# Altium project MicrobitBoardExtend.PrjPcb
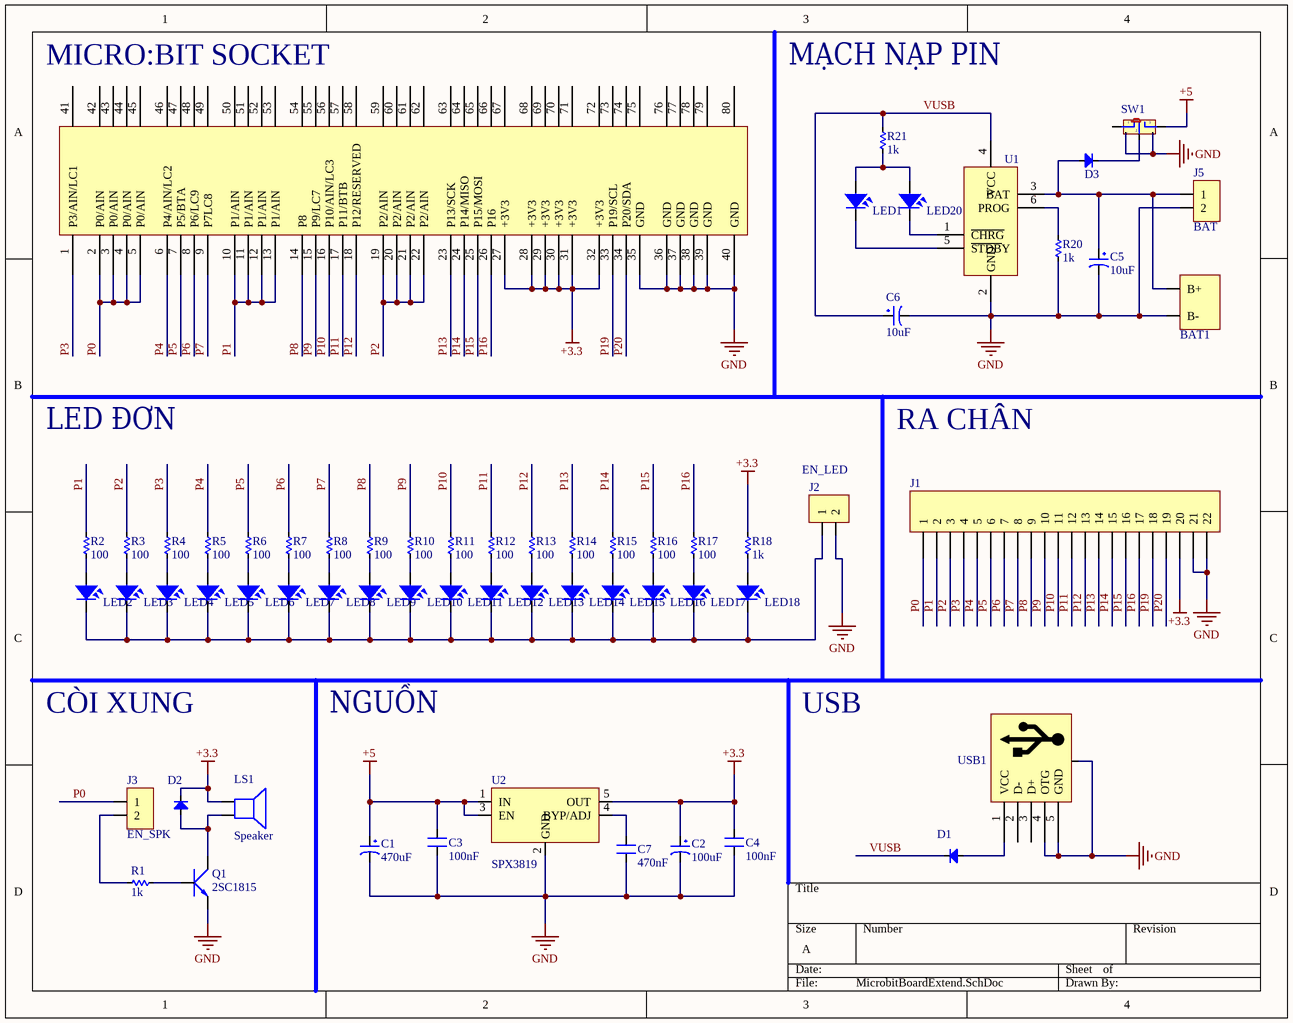
[diagram p0: MicrobitBoardExtend.SchDoc]
1 sheet, 61 parts. Net scope: global (net labels, ports and power ports of the same name join across sheets).
Board file: MicrobitBoardExtend.PcbDoc

## Sheet MicrobitBoardExtend.SchDoc
size A

### Parts
BAT1  BATERRY SOCKET  [BAT_SOCKET]  (value not drawn)
BBC1  BBC_SOCKET  [BBC_SK_DIP]  (value not drawn)
C1  470uF  [tu tantalum smd7343]
C2  100uF  [tu tantalum smd3528]
C3  100nF  [CN-SMD-0805]
C4  100nF  [CN-SMD-0805]
C5  10uF  [tu tantalum smd3528]
C6  10uF  [tu tantalum smd3528]
C7  470nF  [CN-SMD-0805]
D1  SS34  [DIO-SMD-123]  (value not drawn)
D2  SS34  [DIO-SMD-123]  (value not drawn)
D3  SS34  [DIO-SMD-123]  (value not drawn)
J1  JP22  [JP22-D1T]  (value not drawn)
J2  EN_LED  [JP2-CLOSED]
J3  EN_SPK  [JP2-CLOSED]
J5  BAT  [JP2-D1T]
LED1  F  [LED-0805-Blue]  (value not drawn)
LED2  LED  [LED-3MM-BLUE]  (value not drawn)
LED3  LED  [LED-3MM-BLUE]  (value not drawn)
LED4  LED  [LED-3MM-BLUE]  (value not drawn)
LED5  LED  [LED-3MM-BLUE]  (value not drawn)
LED6  LED  [LED-3MM-BLUE]  (value not drawn)
LED7  LED  [LED-3MM-BLUE]  (value not drawn)
LED8  LED  [LED-3MM-BLUE]  (value not drawn)
LED9  LED  [LED-3MM-BLUE]  (value not drawn)
LED10  LED  [LED-3MM-BLUE]  (value not drawn)
LED11  LED  [LED-3MM-BLUE]  (value not drawn)
LED12  LED  [LED-3MM-BLUE]  (value not drawn)
LED13  LED  [LED-3MM-BLUE]  (value not drawn)
LED14  LED  [LED-3MM-BLUE]  (value not drawn)
LED15  LED  [LED-3MM-BLUE]  (value not drawn)
LED16  LED  [LED-3MM-BLUE]  (value not drawn)
LED17  LED  [LED-3MM-BLUE]  (value not drawn)
LED18  PWR  [LED-0805-Blue]  (value not drawn)
LED20  C  [LED-0805-Blue]  (value not drawn)
LS1  Speaker  [SPEAKER]
Q1  2SC1815  [SOT23-321]
R1  1k  [RES-SMD-0805]
R2  100  [RES-SMD-0805]
R3  100  [RES-SMD-0805]
R4  100  [RES-SMD-0805]
R5  100  [RES-SMD-0805]
R6  100  [RES-SMD-0805]
R7  100  [RES-SMD-0805]
R8  100  [RES-SMD-0805]
R9  100  [RES-SMD-0805]
R10  100  [RES-SMD-0805]
R11  100  [RES-SMD-0805]
R12  100  [RES-SMD-0805]
R13  100  [RES-SMD-0805]
R14  100  [RES-SMD-0805]
R15  100  [RES-SMD-0805]
R16  100  [RES-SMD-0805]
R17  100  [RES-SMD-0805]
R18  1k  [RES-SMD-0805]
R20  1k  [RES-SMD-0805]
R21  1k  [RES-SMD-0805]
SW1  SW102A  [SW102]  (value not drawn)
U1  TP4057  [SOT23-6]  (value not drawn)
U2  SPX3819  [SOT23-5]
USB1  PWR  [MicroUSB]  (value not drawn)

### Nets
+3.3: BBC1.27(+3V3) BBC1.28(+3V3) BBC1.29(+3V3) BBC1.30(+3V3) BBC1.31(+3V3) BBC1.32(+3V3) C2.1 C4.1 D2.2(K) J1.20 LS1.1 R18.2 U2.5(OUT)
+5: C1.1 C3.1 SW1.3 U2.1(IN) U2.3(EN)
GND: BAT1.2(B-) BBC1.35(GND) BBC1.36(GND) BBC1.37(GND) BBC1.38(GND) BBC1.39(GND) BBC1.40(GND) C1.2 C2.2 C3.2 C4.2 C5.2 C6.2 C7.2 J1.21 J1.22 J2.2 J5.2 Q1.1(E) R20.1 SW1.4 SW1.5 U1.2(GND) U2.2(GND) USB1.0(GND) USB1.4(OTG) USB1.5(GND)
P0: BBC1.2(P0/AIN) BBC1.3(P0/AIN) BBC1.4(P0/AIN) BBC1.5(P0/AIN) J1.1 J3.1
P1: BBC1.10(P1/AIN) BBC1.11(P1/AIN) BBC1.12(P1/AIN) BBC1.13(P1/AIN) J1.2 R2.2
P2: BBC1.19(P2/AIN) BBC1.20(P2/AIN) BBC1.21(P2/AIN) BBC1.22(P2/AIN) J1.3 R3.2
P3: BBC1.1(P3/AIN/LC1) J1.4 R4.2
P4: BBC1.6(P4/AIN/LC2) J1.5 R5.2
P5: BBC1.7(P5/BTA) J1.6 R6.2
P6: BBC1.8(P6/LC9) J1.7 R7.2
P7: BBC1.9(P7LC8) J1.8 R8.2
P8: BBC1.14(P8) J1.9 R9.2
P9: BBC1.15(P9/LC7) J1.10 R10.2
P10: BBC1.16(P10/AIN/LC3) J1.11 R11.2
P11: BBC1.17(P11/BTB) J1.12 R12.2
P12: BBC1.18(P12/RESERVED) J1.13 R13.2
P13: BBC1.23(P13/SCK) J1.14 R14.2
P14: BBC1.24(P14/MISO) J1.15 R15.2
P15: BBC1.25(P15/MOSI) J1.16 R16.2
P16: BBC1.26(P16) J1.17 R17.2
P19: BBC1.33(P19/SCL) J1.18
P20: BBC1.34(P20/SDA) J1.19
VUSB: C6.1 D1.2(K) R21.2 U1.4(VCC)
NetBAT1_1: BAT1.1(B+) C5.1 D3.1(A) J5.1 U1.3(BAT)
NetC7_1: C7.1 U2.4(BYP/ADJ)
NetD1_1: D1.1(A) USB1.1(VCC)
NetD2_1: D2.1(A) LS1.2 Q1.2(C)
NetD3_2: D3.2(K) SW1.2
NetJ2_1: J2.1 LED2.2 LED3.2 LED4.2 LED5.2 LED6.2 LED7.2 LED8.2 LED9.2 LED10.2 LED11.2 LED12.2 LED13.2 LED14.2 LED15.2 LED16.2 LED17.2 LED18.2
NetJ3_2: J3.2 R1.2
NetLED1_1: LED1.1 LED20.1 R21.1
NetLED1_2: LED1.2 U1.5(~{STDB}Y)
NetLED2_1: LED2.1 R2.1
NetLED3_1: LED3.1 R3.1
NetLED4_1: LED4.1 R4.1
NetLED5_1: LED5.1 R5.1
NetLED6_1: LED6.1 R6.1
NetLED7_1: LED7.1 R7.1
NetLED8_1: LED8.1 R8.1
NetLED9_1: LED9.1 R9.1
NetLED10_1: LED10.1 R10.1
NetLED11_1: LED11.1 R11.1
NetLED12_1: LED12.1 R12.1
NetLED13_1: LED13.1 R13.1
NetLED14_1: LED14.1 R14.1
NetLED15_1: LED15.1 R15.1
NetLED16_1: LED16.1 R16.1
NetLED17_1: LED17.1 R17.1
NetLED18_1: LED18.1 R18.1
NetLED20_2: LED20.2 U1.1(~{CHRG})
NetQ1_3: Q1.3(B) R1.1
NetR20_2: R20.2 U1.6(PROG)

Not connected (* = marked no-connect by the designer): BBC1 41(P3) 42(P0) 43(P0) 44(P0) 45(P0) 46(P4) 47(P5) 48(P6) 49(P7) 50(P1) 51(P1) 52(P1) 53(P1) 54(P8) 55(P9) 56(P10) 57(P11) 58(P12) 59(P2) 60(P2) 61(P2) 62(P2) 63(P13) 64(P14) 65(P15) 66(P16) 67(+3V3) 68(+3V3) 69(+3V3) 70(+3V3) 71(+3V3) 72(+3V3) 73(P19) 74(P20) 75(GND) 76(GND) 77(GND) 78(GND) 79(GND) 80(GND); SW1 1; USB1 2(D-) 3(D+)

### Notes on the sheet
- MICRO:BIT SOCKET
- MẠCH NẠP PIN
- LED ĐƠN
- RA CHÂN
- CÒI XUNG
- NGUỒN
- USB

### Library data of the parts
BAT1 = BAT_SOCKET
C1 = Tu tantalum 470uF 10V SMD7343: Dán; Don_Vi: Con; So_Chan: 2; Ten_Linh_Kien: Tụ tantalum 477A-470uF 10V SMD7343; Ma_Hang: MH001956; Chung_Loai: Dán; Kieu_Chan: *
C2 = Tu tantalum 100uF 6.3V SMD3528: Dán; Don_Vi: Con; So_Chan: 2; Ten_Linh_Kien: Tụ tantalum 107J-100uF 6.3V SMD3528; Ma_Hang: MH007595; Chung_Loai: Dán; Kieu_Chan: *
C3 C4 C7 = CN: Value: 33pF
C5 C6 = Tu tantalum 10uF 16V SMD3528: Dán; Don_Vi: Con; So_Chan: 2; Ten_Linh_Kien: Tụ tantalum 106C-10uF 16V SMD3528; Ma_Hang: MH007474; Chung_Loai: Dán; Kieu_Chan: *
D1-D3 = Diode SMD: Default Diode; Code - JEDEC: DO-214-AB; Value: 1N5007; Published: 8-Jun-2000; Revision: July-2002: Re-released for DXP Platform.; Publisher: Altium Limited
J1 = JP22: WR-PHD 2.54 mm Angled Socket Header; Manufacturer: W¨¹rth Elektronik eiSos GmbH; partNo: 613022143121; ComponentLink1 Description: Manufacturer; ComponentLink2 Description: Datasheet; NoPins: 22; Created Date: 29 March 2013; ComponentLink1URL: http://www.we-online.com; ComponentLink2URL: http://katalog.we-online.de/em/datasheet/6130xx143121.pdf; Created by: Karrer Zheng
J2 J3 J5 = JP2: WR-PHD 2.54 mm Angled Socket Header; Manufacturer: W¨¹rth Elektronik eiSos GmbH; partNo: 613002143121; ComponentLink1 Description: Manufacturer; ComponentLink2 Description: Datasheet; NoPins: 02; Created Date: 29 March 2013; ComponentLink1URL: http://www.we-online.com; ComponentLink2URL: http://katalog.we-online.de/em/datasheet/6130xx143121.pdf; Created by: Karrer Zheng
LED1 LED18 LED20 = LED SMD: Value: LED 3 - 5 ly 2 Colour
LED2-LED17 = LED: LED Single colour Green and Red; Value: LED 3 ly Single Colour
LS1 = Speaker: Loudspeaker; Published: 24-Mar-1999; LatestRevisionDate: 17-Jul-2002; LatestRevisionNote: Re-released for DXP Platform.; PackageReference: PIN2; Publisher: Altium Limited
Q1 = 2SC1815: NPN 600mW, ECB; Value: C1815
R1-R18 R20 R21 = Res-SMD: Resistor; Manufacturer: Generic Components; Class: Passive; Published: 08/06/2000; Publisher: Altium Hobart Technology Centre
SW1 = SW102A: Switch 102 on Broad; Value: Switch 102 On Board
USB1 = MicroUSB
BBC1 = BBC_SOCKET: DeviceName: BBC_SOCKET; LibraryName: microbit; DeviceSetName: BBC_SOCKET; Package: BBC_SOCKET